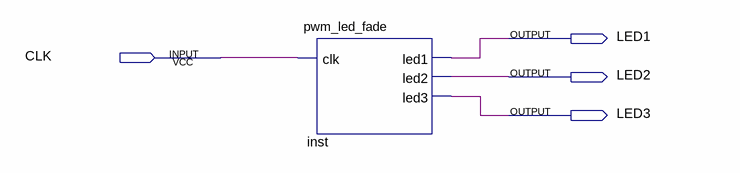
[diagram p0: schematic sheet]
// Quartus schematic PWM_LED_Dimming.bdf as structural Verilog: 1 symbols, 4 pins
module PWM_LED_Dimming (
  input  CLK,
  output LED1,
  output LED2,
  output LED3
);

  pwm_led_fade inst (.clk(CLK), .led1(LED1), .led2(LED2), .led3(LED3));
endmodule
